# EAGLE schematic Lantern (EAGLE 9.3.2)
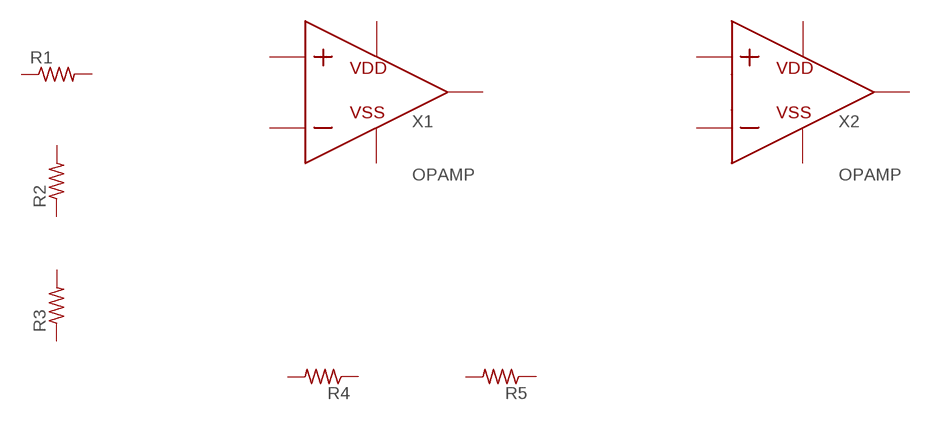
[diagram p0: schematic, sheet 1]

## Parts
R1  R-US_0204/7  [0204/7]
R2  R-US_0204/7  [0204/7]
R3  R-US_0204/7  [0204/7]
R4  R-US_0204/7  [0204/7]
R5  R-US_0204/7  [0204/7]
X1  OPAMP  (no package)
X2  OPAMP  (no package)
Unconnected: R1.1 R1.2 R2.1 R2.2 R3.1 R3.2 R4.1 R4.2 R5.1 R5.2 X1.N X1.P X1.VDD X1.VOUT X1.VSS X2.N X2.P X2.VDD X2.VOUT X2.VSS

## Library data of the parts
R1-R5 = rcl:R-US_: RESISTOR, American symbol; SPICEPREFIX: R
X1 X2 = ngspice-simulation:OPAMP: Operational amplifier with power pins